# Altium project 100213563-EM411-202401.PrjPcb
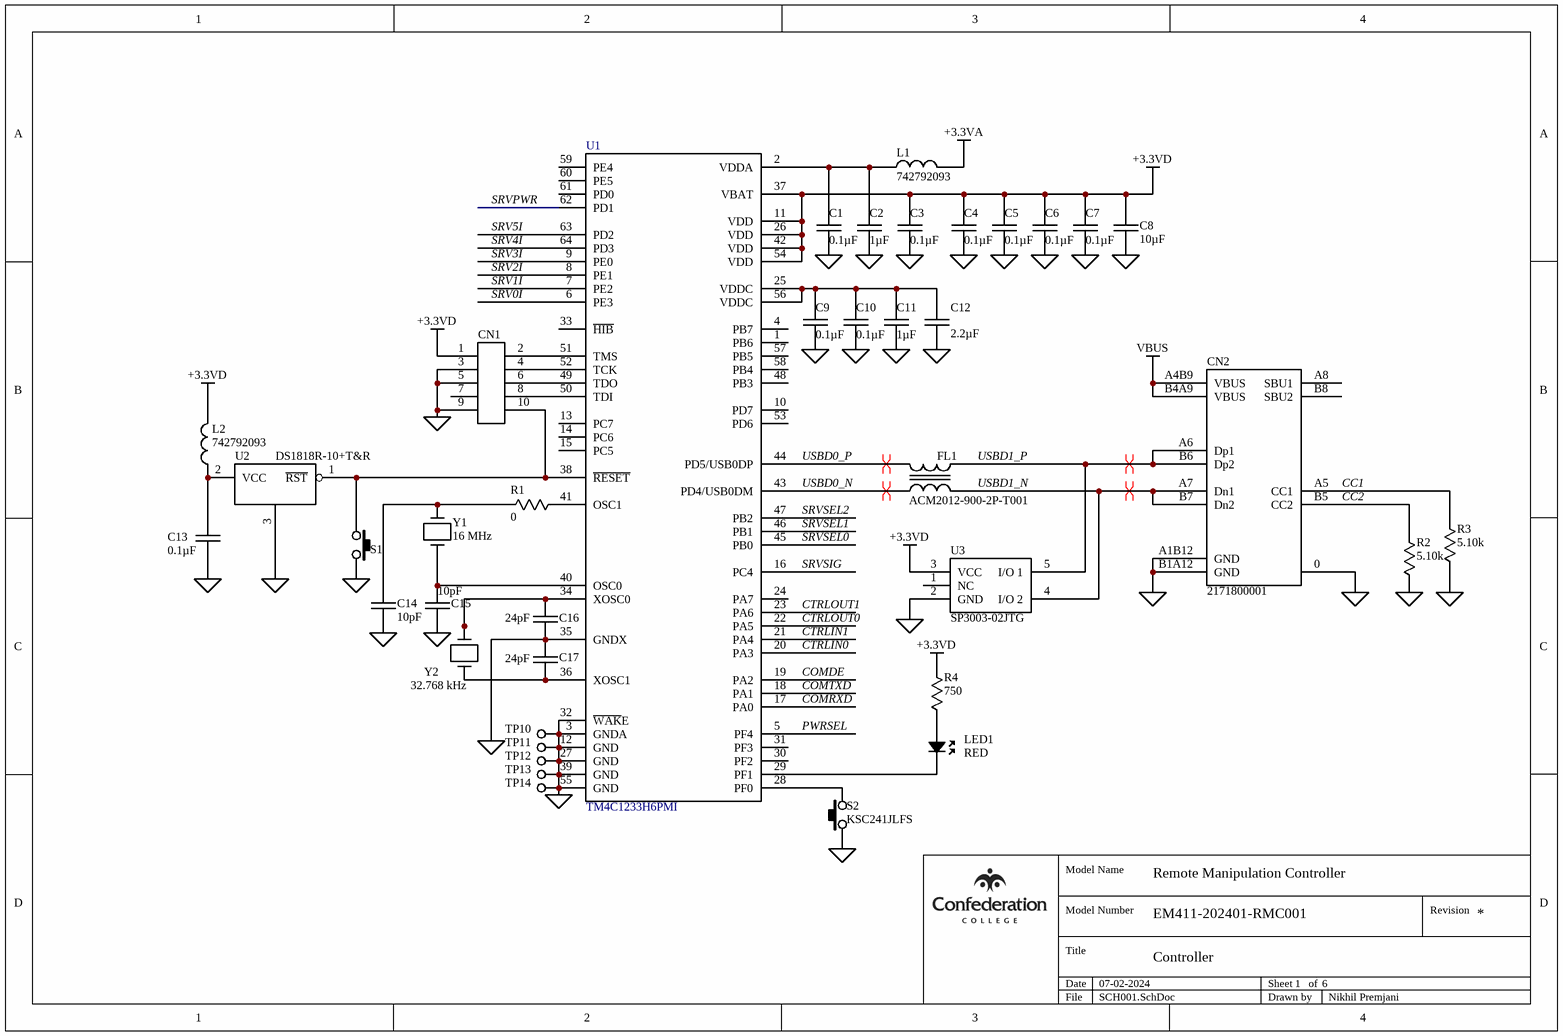
[diagram p0: SCH001.SchDoc]
6 sheets, 154 parts. Net scope: global (net labels, ports and power ports of the same name join across sheets).
Board file: PCB1.PcbDoc
Sheets:
  SCH001.SchDoc
  SCH002.SchDoc
  SCH003.SchDoc
  SCH004.SchDoc
  SCH005.SchDoc
  SCH006.SchDoc

## Sheet SCH001.SchDoc: Controller
size A4; Date: 07-02-2024; CompanyName: Confederation College; DrawnBy: Nikhil Premjani; SheetNumber: 1; SheetTotal: 6; Model: Remote Manipulation Controller; ModelNumber: EM411-202401-RMC001; ModelName: Remote Manipulation Controller

### Parts
C1  0.1µF  [CAPC2012X14N]
C2  1µF  [CAPC2012X14N]
C3  0.1µF  [CAPC2012X14N]
C4  0.1µF  [CAPC2012X14N]
C5  0.1µF  [CAPC2012X14N]
C6  0.1µF  [CAPC2012X14N]
C7  0.1µF  [CAPC2012X14N]
C8  10µF  [CAPC2012X14N]
C9  0.1µF  [CAPC2012X14N]
C10  0.1µF  [CAPC2012X14N]
C11  1µF  [CAPC2012X14N]
C12  2.2µF  [CAPC2012X14N]
C13  0.1µF  [CAPC2012X14N]
C14  10pF  [CAPC2012X09N]
C15  10pF  [CAPC2012X09N]
C16  24pF  [CAPC2012X09N]
C17  24pF  [CAPC2012X09N]
CN1  GRPB052VWVN-RC  [SULLINS_GRPB052VWVN-RC]  (value not drawn)
CN2  2171800001  [MOLEX_2171800001]
FL1  ACM2012-900-2P-T001  [LITTELFUSE_ACM2012-900-2P-T001]
L1  742792093  [INDC2012X11N]
L2  742792093  [INDC2012X11N]
LED1  RED  [LEDM3228X19N]
R1  0  [VISHAY_RESC2012X06N]
R2  5.10k  [RESC2012X06N]
R3  5.10k  [RESC2012X06N]
R4  750  [RESC2012X06N]
S1  KSC241JLFS  [CK_KSC241JLFS]  (value not drawn)
S2  KSC241JLFS  [CK_KSC241JLFS]
TP10  Test Point  [TP100]  (value not drawn)  (no BOM)
TP11  Test Point  [TP100]  (value not drawn)  (no BOM)
TP12  Test Point  [TP100]  (value not drawn)  (no BOM)
TP13  Test Point  [TP100]  (value not drawn)  (no BOM)
TP14  Test Point  [TP100]  (value not drawn)  (no BOM)
U1  TM4C1233H6PMI  [TSQFP50P1200X1200X145-64N]
U2  DS1818R-10+T&R  [SOT95P237X112-3N]
U3  SP3003-02JTG  [SOT65P220X110-5N]
Y1  16 MHz  [ABRACON_ABM3]
Y2  32.768 kHz  [ABRACON_AB26TRB]

### Nets
+3.3VA: L1.2
+3.3VD: C3.1 C4.1 C5.1 C6.1 C7.1 C8.1 CN1.1 L2.2 R4.2 U1.11(VDD) U1.26(VDD) U1.37(VBAT) U1.42(VDD) U1.54(VDD) U3.3(VCC)
GND: C1.2 C2.2 C3.2 C4.2 C5.2 C6.2 C7.2 C8.2 C9.2 C10.2 C11.2 C12.2 C13.2 C14.2 C15.2 C16.2 C17.1 CN1.3 CN1.5 CN1.9 CN2.0 CN2.A1B12(GND) CN2.B1A12(GND) R2.1 R3.1 S1.1 S2.2 TP10.1 TP11.1 TP12.1 TP13.1 TP14.1 U1.3(GNDA) U1.12(GND) U1.27(GND) U1.32(~{WAK}E) U1.35(GNDX) U1.39(GND) U1.55(GND) U2.3(GND) U3.2(GND)
VBUS: CN2.A4B9(VBUS) CN2.B4A9(VBUS)
CC1: CN2.A5(CC1) R3.2
CC2: CN2.B5(CC2) R2.2
COMDE: U1.19(PA2)
COMRXD: U1.17(PA0)
COMTXD: U1.18(PA1)
CTRLIN0: U1.20(PA3)
CTRLIN1: U1.21(PA4)
CTRLOUT0: U1.22(PA5)
CTRLOUT1: U1.23(PA6)
PWRSEL: U1.5(PF4)
SRV0I: U1.6(PE3)
SRV1I: U1.7(PE2)
SRV2I: U1.8(PE1)
SRV3I: U1.9(PE0)
SRV4I: U1.64(PD3)
SRV5I: U1.63(PD2)
SRVPWR: U1.62(PD1)
SRVSEL0: U1.45(PB0)
SRVSEL1: U1.46(PB1)
SRVSEL2: U1.47(PB2)
SRVSIG: U1.16(PC4)
USBD0_N: FL1.2 U1.43(PD4/USB0DM)
USBD0_P: FL1.1 U1.44(PD5/USB0DP)
USBD1_N: CN2.A7(Dn1) CN2.B7(Dn2) FL1.3 U3.4(I/O_2)
USBD1_P: CN2.A6(Dp1) CN2.B6(Dp2) FL1.4 U3.5(I/O_1)
NetC1_1: C1.1 C2.1 L1.1 U1.2(VDDA)
NetC9_1: C9.1 C10.1 C11.1 C12.1 U1.25(VDDC) U1.56(VDDC)
NetC13_1: C13.1 L2.1 U2.2(VCC)
NetC14_1: C14.1 R1.1 Y1.1
NetC15_1: C15.1 U1.40(OSC0) Y1.2
NetC16_1: C16.1 U1.34(XOSC0) Y2.2
NetC17_2: C17.2 U1.36(XOSC1) Y2.1
NetCN1_2: CN1.2 U1.51(TMS)
NetCN1_4: CN1.4 U1.52(TCK)
NetCN1_6: CN1.6 U1.49(TDO)
NetCN1_8: CN1.8 U1.50(TDI)
NetCN1_10: CN1.10 S1.2 U1.38(~{RESET}) U2.1(~{RST})
NetLED1_A: LED1.A R4.1
NetLED1_K: LED1.K U1.29(PF1)
NetR1_2: R1.2 U1.41(OSC1)
NetS2_1: S2.1 U1.28(PF0)

Not connected (* = marked no-connect by the designer): CN1 7; CN2 A8(SBU1) B8(SBU2); U1 1(PB6) 4(PB7) 10(PD7) 13(PC7) 14(PC6) 15(PC5) 24(PA7) 30(PF2) 31(PF3) 33(~{HIB}) 48(PB3) 53(PD6) 57(PB5) 58(PB4) 59(PE4) 60(PE5) 61(PD0); U3 1(NC)

### Layout directives
differential pair; differential pair class USB: USBD0_N, USBD0_P, USBD1_N, USBD1_P

### Notes on the sheet
- Model Number
- Model Name
- Revision
- Title
- Date
- Sheet
- of
- File
- Drawn by

### Library data of the parts
C1 C3-C7 C9 C10 C13 = UMK212B7104KGHT: 0.1µF/50V/±10% X7R Ceramic Chip Capacitor; Manufacturer: Taiyo Yuden; PartNumber: UMK212B7104KGHT
C2 C11 = CL21B105KBFNNNG: 1µF/50V/±10% X7R Ceramic Chip Capacitor; Manufacturer: Samsung Electro-Mechanics; PartNumber: CL21B105KBFNNNG
C8 = CL21A106KAFN3NE: 10µF/25V 10% X5R Multi-Layer Ceramic Capacitor; Manufacturer: Samsung Electro-Mechanics; PartNumber: CL21A106KAFN3NE
C12 = UMK212BB7225KG-T: 2.2µF/50V/10% Multilayer Ceramic Chip Capacitor; Manufacturer: Taiyo Yuden; PartNumber: UMK212BB7225KG-T
C14 C15 = 08051A100KAT: 10pF/100V/±10% C0G (NP0) Ceramic Chip Capacitor; Manufacturer: Kyocera/AVX; PartNumber: 08051A100KAT
C16 C17 = 08055A240JAT: 24pF/50V/±5% C0G (NP0) Ceramic Chip Capacitor; Manufacturer: Kyocera/AVX; PartNumber: 08055A240JAT
CN1 = GRPB052VWVN-RC: .050"[1.27mm] Contact Centers, Male Header; Manufacturer: Sullins Connector Solutions, Inc.; PartNumber: GRPB052VWVN-RC
CN2 = 2171800001: USB-C Receptacle, Right-Angle, Surface Mount, Top Mount, Center Height 5.9mm, Single Row, 16 Circuits; Manufacturer: Molex; PartNumber: 2171800001
FL1 = ACM2012-900-2P-T001: Common Mode Filter; Manufacturer: TDK; PartNumber: ACM2012-900-2P-T001
L1 L2 = 742792093: Multilayer SMD Ferrite; Manufacturer: Wurth Elektronik; PartNumber: 742792093
LED1 = 597-3008-207F: Micro LED, 597 Series, Red, SMD LED; Manufacturer: Dialight Corporation; PartNumber: 597-3008-207F
R1 = CRCW08050000Z0EAHP: 0, Jumper, Pulse Proof, High Power Thick Film Chip Resistor; Manufacturer: Vishay Intertechnology; PartNumber: CRCW08050000Z0EAHP
R2 R3 = CR0805-FX-5101ELF: 5.10k, 1%, 0.125W Thick Film Chip Resistor; Manufacturer: Bourns; PartNumber: CR0805-FX-4421ELF
R4 = CR0805-FX-7500ELF: 750, 1%, 0.125W Thick Film Chip Resistor; Manufacturer: Bourns; PartNumber: CR0805-FX-7500ELF
S1 S2 = KSC241JLFS: KSC Series Sealed Tact Switch for SMT; Manufacturer: C&K Components; PartNumber: KSC241JLFS
TP10-TP14 = TP3: Test Point, Surface Mount, 3 mm; Manufacturer: Confederation College; PartNumber: N/A
U1 = TM4C1233H6PMI: Microcontroller; Manufacturer: Texas Instruments; PartNumber: TM4C1233H6PMI
U2 = DS1818R-10+T&R: 3.3 V EconoReset with Pushbutton; Manufacturer: Maxim Integrated; PartNumber: DS1818R-10+T&R
U3 = SP3003-02JTG: TVS Diode Array - Low Capacitance ESD Protection; Manufacturer: Littelfuse; PartNumber: SP3003-02JTG
Y1 = ABM3-16.000MHZ-B2-T: 16 MHz Miniature Ceramic SMD Crystal; Manufacturer: Abracon Corporation; PartNumber: ABM3-16.000MHZ-B2-T
Y2 = AB26TRB-32.768KHZ-T: 32.768 kHz Radial Can Crystal; Manufacturer: Abracon Corporation; PartNumber: AB26TRB-32.768KHZ-T

## Sheet SCH002.SchDoc: Servo Interface
size A4; Date: 07-02-2024; DrawnBy: Nikhil Premjani; SheetNumber: 2; SheetTotal: 6; ModelNumber: EM411-202401-RMC001; ModelName: Remote Manipulation Controller
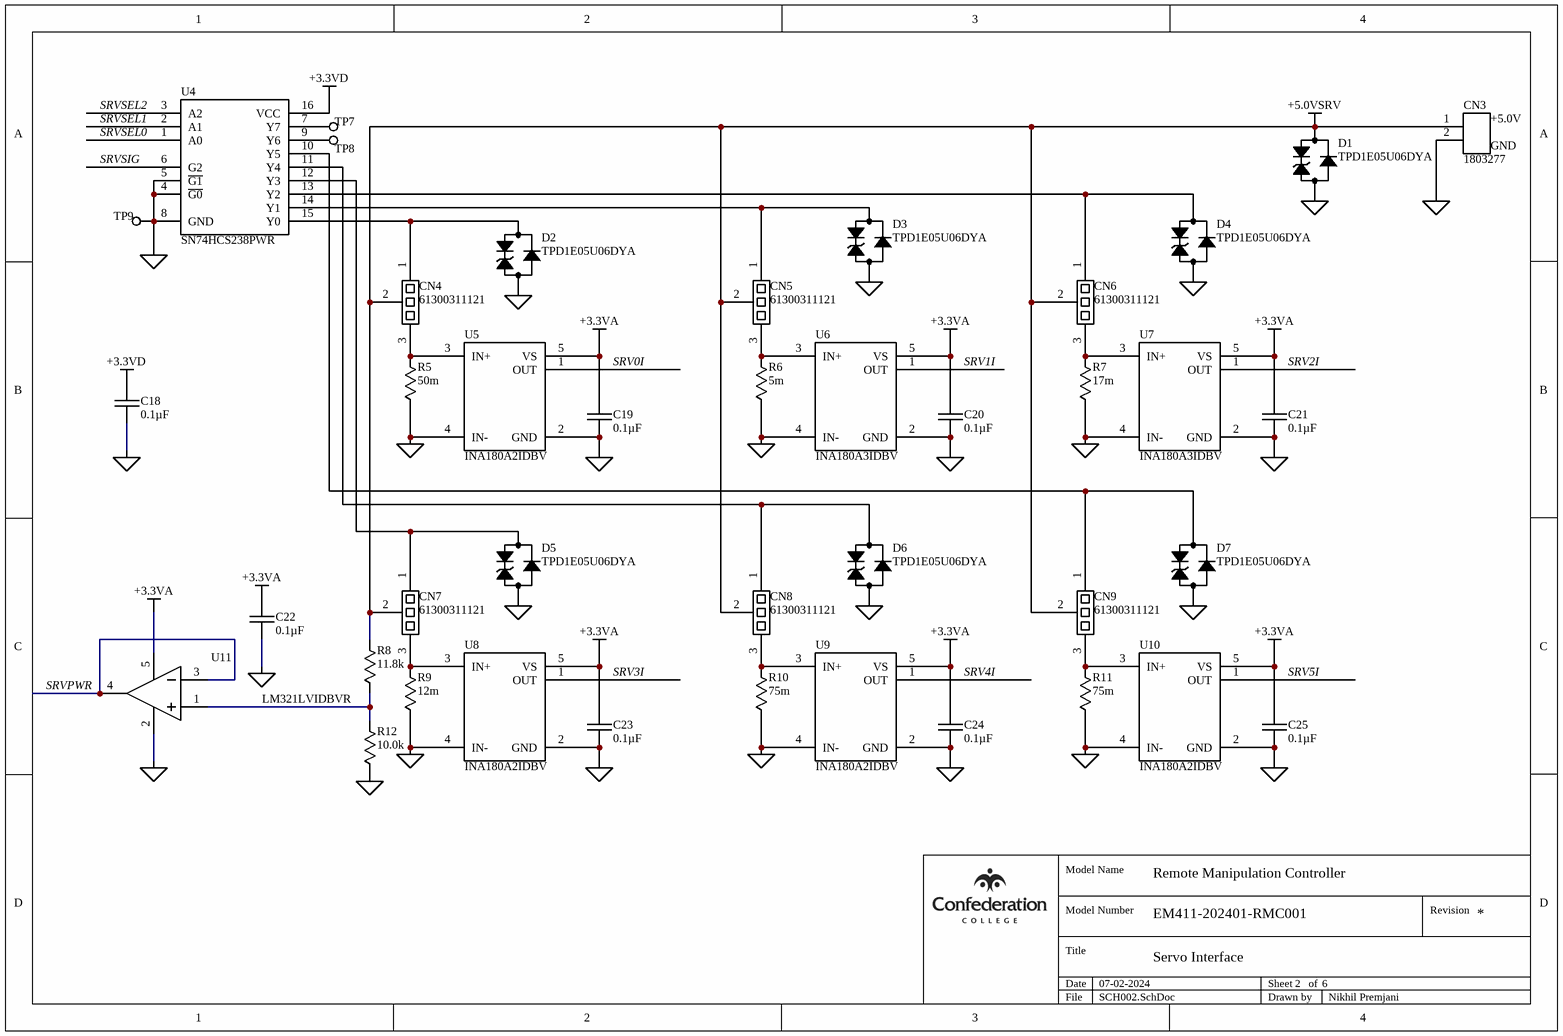
[diagram p1: SCH002.SchDoc]

### Parts
C18  0.1µF  [CAPC2012X14N]
C19  0.1µF  [CAPC2012X14N]
C20  0.1µF  [CAPC2012X14N]
C21  0.1µF  [CAPC2012X14N]
C22  0.1µF  [CAPC2012X14N]
C23  0.1µF  [CAPC2012X14N]
C24  0.1µF  [CAPC2012X14N]
C25  0.1µF  [CAPC2012X14N]
CN3  1803277  [PHOENIX_1803277]
CN4  61300311121  [WURTH_61300311121]
CN5  61300311121  [WURTH_61300311121]
CN6  61300311121  [WURTH_61300311121]
CN7  61300311121  [WURTH_61300311121]
CN8  61300311121  [WURTH_61300311121]
CN9  61300311121  [WURTH_61300311121]
D1  TPD1E05U06DYA  [SODFL160X77-2N]
D2  TPD1E05U06DYA  [SODFL160X77-2N]
D3  TPD1E05U06DYA  [SODFL160X77-2N]
D4  TPD1E05U06DYA  [SODFL160X77-2N]
D5  TPD1E05U06DYA  [SODFL160X77-2N]
D6  TPD1E05U06DYA  [SODFL160X77-2N]
D7  TPD1E05U06DYA  [SODFL160X77-2N]
R5  50m  [RESC2012X08N]
R6  5m  [RESC2012X08N]
R7  17m  [RESC2013X05N]
R8  11.8k  [RESC2012X06N]
R9  12m  [RESC2012X08N]
R10  75m  [RESC2012X08N]
R11  75m  [RESC2012X08N]
R12  10.0k  [RESC2012X06N]
TP7  Test Point  [TP100]  (value not drawn)  (no BOM)
TP8  Test Point  [TP100]  (value not drawn)  (no BOM)
TP9  Test Point  [TP100]  (value not drawn)  (no BOM)
U4  SN74HCS238PWR  [TSOP65P640X120-16N]
U5  INA180A2IDBV  [SOT95P280X145-5N]
U6  INA180A3IDBV  [SOT95P280X145-5N]
U7  INA180A3IDBV  [SOT95P280X145-5N]
U8  INA180A2IDBV  [SOT95P280X145-5N]
U9  INA180A2IDBV  [SOT95P280X145-5N]
U10  INA180A2IDBV  [SOT95P280X145-5N]
U11  LM321LVIDBVR  [SOT95P280X145-5N]

### Nets
+3.3VA: C19.1 C20.1 C21.1 C22.1 C23.1 C24.1 C25.1 U5.5(VS) U6.5(VS) U7.5(VS) U8.5(VS) U9.5(VS) U10.5(VS) U11.5(V+)
+3.3VD: C18.1 U4.16(VCC)
+5.0VSRV: CN3.1 CN4.2 CN5.2 CN6.2 CN7.2 CN8.2 CN9.2 D1.K R8.2
GND: C18.2 C19.2 C20.2 C21.2 C22.2 C23.2 C24.2 C25.2 CN3.2 D1.A D2.A D3.A D4.A D5.A D6.A D7.A R5.1 R6.1 R7.1 R9.1 R10.1 R11.1 R12.1 TP9.1 U4.4(~{G0}) U4.5(~{G1}) U4.8(GND) U5.2(GND) U5.4(IN-) U6.2(GND) U6.4(IN-) U7.2(GND) U7.4(IN-) U8.2(GND) U8.4(IN-) U9.2(GND) U9.4(IN-) U10.2(GND) U10.4(IN-) U11.2(V-)
SRV0I: U5.1(OUT)
SRV1I: U6.1(OUT)
SRV2I: U7.1(OUT)
SRV3I: U8.1(OUT)
SRV4I: U9.1(OUT)
SRV5I: U10.1(OUT)
SRVPWR: U11.3(IN-) U11.4(OUT)
SRVSEL0: U4.1(A0)
SRVSEL1: U4.2(A1)
SRVSEL2: U4.3(A2)
SRVSIG: U4.6(G2)
NetCN4_1: CN4.1 D2.K U4.15(Y0)
NetCN4_3: CN4.3 R5.2 U5.3(IN+)
NetCN5_1: CN5.1 D3.K U4.14(Y1)
NetCN5_3: CN5.3 R6.2 U6.3(IN+)
NetCN6_1: CN6.1 D4.K U4.13(Y2)
NetCN6_3: CN6.3 R7.2 U7.3(IN+)
NetCN7_1: CN7.1 D5.K U4.12(Y3)
NetCN7_3: CN7.3 R9.2 U8.3(IN+)
NetCN8_1: CN8.1 D6.K U4.11(Y4)
NetCN8_3: CN8.3 R10.2 U9.3(IN+)
NetCN9_1: CN9.1 D7.K U4.10(Y5)
NetCN9_3: CN9.3 R11.2 U10.3(IN+)
NetR8_1: R8.1 R12.2 U11.1(IN+)
NetTP7_1: TP7.1 U4.7(Y7)
NetTP8_1: TP8.1 U4.9(Y6)

### Notes on the sheet
- (near CN3) +5.0V
- (near CN3) GND
- Model Number
- Model Name
- Revision
- Title
- Date
- Sheet
- of
- File
- Drawn by

### Library data of the parts
C18-C25 = UMK212B7104KGHT: as C1 on sheet SCH001; PartNumber: UMK212B7104KGHT
CN3 = 1803277: MC 1,5/2G-3,81 Pluggable Terminal Block 2 Pos 3.81mm pitch Through Hole Header; Manufacturer: Phoenix Contact; PartNumber: 1803277
CN4-CN9 = 61300311121: Connector Header Through Hole 3 position 0.100" (2.54mm); Manufacturer: Wurth Elektronik; PartNumber: 61300311121
D1-D7 = TPD1E05U06DYA: Single-Channel ESD Protection Diode; Manufacturer: Texas Instruments; PartNumber: TPD1E05U06DYA
R5 = ERJ-6BWFR050V: 50m, 1%, 0.5W Thick Film Chip Resistor; Manufacturer: Panasonic; PartNumber: ERJ-6BWFR050V
R6 = CRF0805-FZ-R005ELF: 5m, 1%, 0.5W Thick Film Chip Resistor; Manufacturer: Bourns; PartNumber: CRF0805-FZ-R005ELF
R7 = WSLP0805R0170FEB: 17m, 1%, 0.5W Thick Film Chip Resistor; Manufacturer: Vishay Dale; PartNumber: WSLP0805R0170FEB
R8 = CR0805-FX-1182ELF: 11.8k, 1%, 0.125W Thick Film Chip Resistor; Manufacturer: Bourns; PartNumber: CR0805-FX-1182ELF
R9 = ERJ-6BWFR012V: 12m, 1%, 0.5W Thick Film Chip Resistor; Manufacturer: Panasonic; PartNumber: ERJ-6BWFR012V
R10 R11 = ERJ-6BWFR075V: 75m, 1%, 0.5W Thick Film Chip Resistor; Manufacturer: Panasonic; PartNumber: ERJ-6BWFR075V
R12 = CR0805-FX-1002ELF: 10.0k, 1%, 0.125W Thick Film Chip Resistor; Manufacturer: Bourns; PartNumber: CR0805-FX-1002ELF
TP7-TP9 = TP3: as TP10 on sheet SCH001; PartNumber: N/A
U4 = SN74HCS238PWR: 3-to 8-Line Decoder/Demultiplexer with Schmitt-Trigger Inputs; Manufacturer: Texas Instruments; PartNumber: SN74HCS238PWR
U5 U8-U10 = INA180A2IDBV: Voltage Output, Current-Sense Amplifiers, Gain 50; Manufacturer: Texas Instruments; PartNumber: INA180A2IDBV
U6 U7 = INA180A3IDBV: Voltage Output, Current-Sense Amplifiers, Gain 100; Manufacturer: Texas Instruments; PartNumber: INA180A3IDBV
U11 = LM321LVIDBVR: Industry Standard, Low Voltage Operational Amplifier; Manufacturer: Texas Instruments; PartNumber: LM321LVIDBVR

## Sheet SCH003.SchDoc: Power Supply
size A4; Date: 07-02-2024; DrawnBy: Nikhil Premjani; SheetNumber: 3; SheetTotal: 6; ModelNumber: EM411-202401-RMC001; ModelName: Remote Manipulation Controller
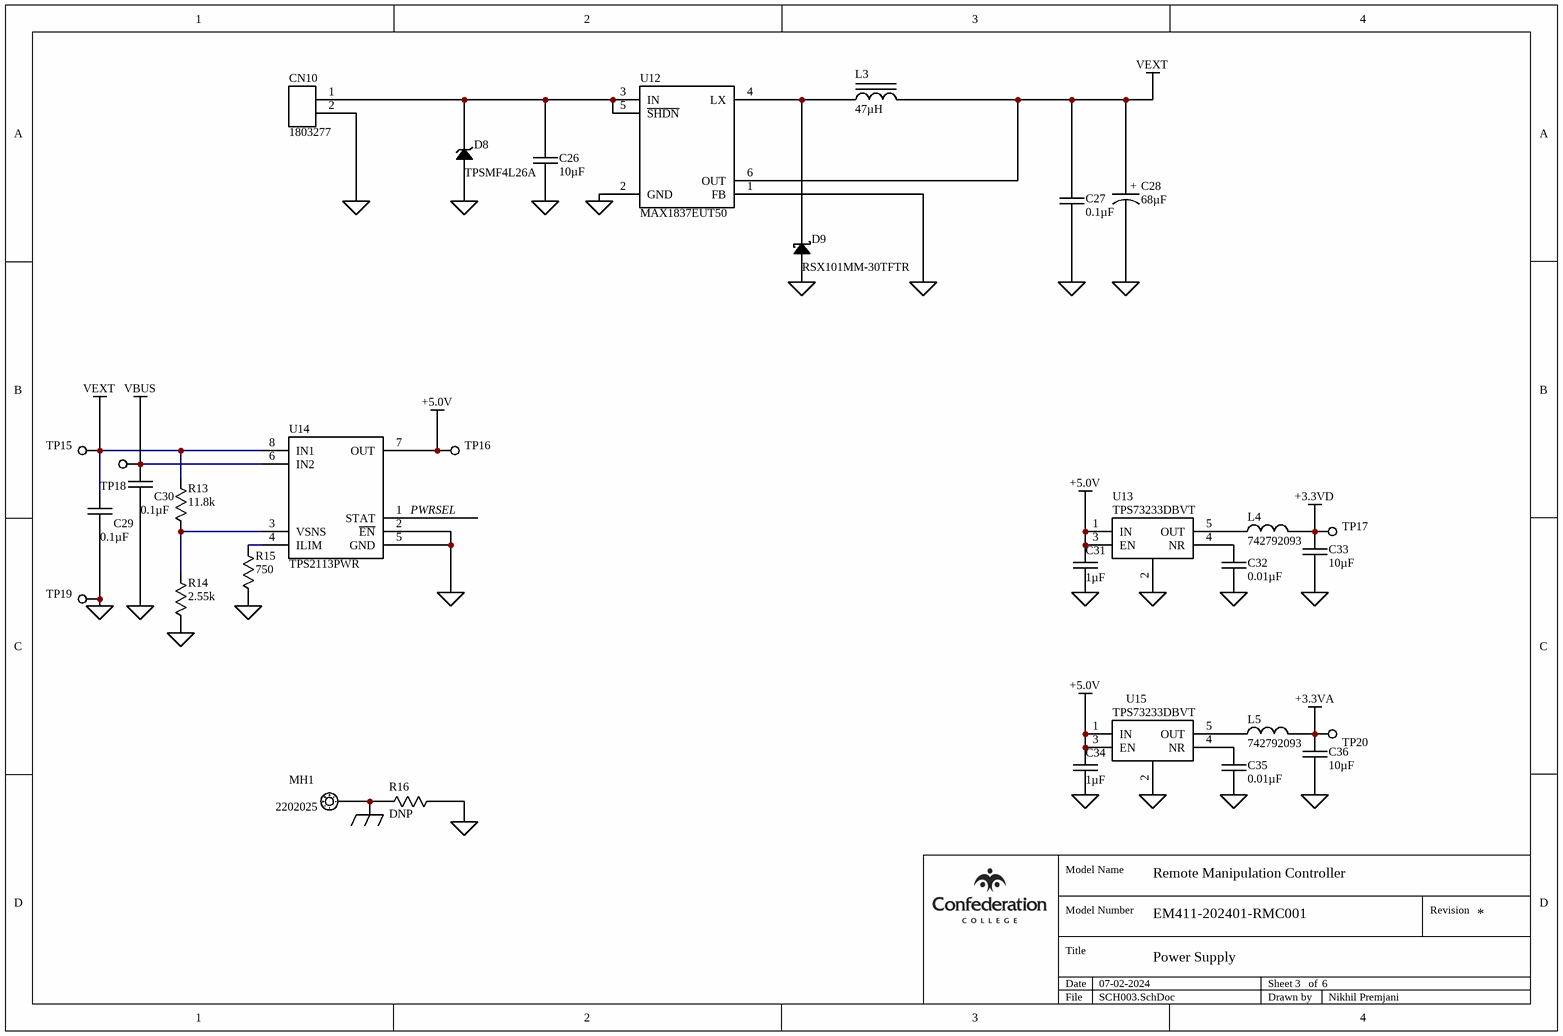
[diagram p2: SCH003.SchDoc]

### Parts
C26  10µF  [CAPC2012X14N]
C27  0.1µF  [CAPC2012X14N]
C28  68µF  [CAPAE7366X60M]
C29  0.1µF  [CAPC2012X14N]
C30  0.1µF  [CAPC2012X14N]
C31  1µF  [CAPC2012X14N]
C32  0.01µF  [CAPC2012X08N]
C33  10µF  [CAPC2012X14N]
C34  1µF  [CAPC2012X14N]
C35  0.01µF  [CAPC2012X08N]
C36  10µF  [CAPC2012X14N]
CN10  1803277  [PHOENIX_1803277]
D8  TPSMF4L26A  [SODFL370X108-2N]
D9  RSX101MM-30TFTR  [SODFL350X90-2N]
L3  47µH  [INDP102102X40N]
L4  742792093  [INDC2012X11N]
L5  742792093  [INDC2012X11N]
MH1  2202025  [PHOENIX_2202025]
R13  11.8k  [RESC2012X06N]
R14  2.55k  [RESC2012X06N]
R15  750  [RESC2012X06N]
R16  DNP  [RESC2012X06N]  (no BOM)
TP15  Test Point  [TP100]  (value not drawn)  (no BOM)
TP16  Test Point  [TP100]  (value not drawn)  (no BOM)
TP17  Test Point  [TP100]  (value not drawn)  (no BOM)
TP18  Test Point  [TP100]  (value not drawn)  (no BOM)
TP19  Test Point  [TP100]  (value not drawn)  (no BOM)
TP20  Test Point  [TP100]  (value not drawn)  (no BOM)
U12  MAX1837EUT50  [SOT95P280X145-6N]
U13  TPS73233DBVT  [SOT95P280X145-5N]
U14  TPS2113PWR  [TSOP65P640X120-8N]
U15  TPS73233DBVT  [SOT95P280X145-5N]

### Nets
+3.3VA: C36.1 L5.2 TP20.1
+3.3VD: C33.1 L4.2 TP17.1
+5.0V: C31.1 C34.1 TP16.1 U13.1(IN) U13.3(EN) U14.7(OUT) U15.1(IN) U15.3(EN)
CHGND: MH1.0 R16.1
GND: C26.2 C27.2 C28.2 C29.2 C30.2 C31.2 C32.2 C33.2 C34.2 C35.2 C36.2 CN10.2 D8.A D9.A R14.1 R15.1 R16.2 TP19.1 U12.1(FB) U12.2(GND) U13.2(GND) U14.2(~{EN}) U14.5(GND) U15.2(GND)
VBUS: C30.1 TP18.1 U14.6(IN2)
VEXT: C27.1 C28.1 C29.1 L3.1 R13.1 TP15.1 U12.6(OUT) U14.8(IN1)
PWRSEL: U14.1(STAT)
NetC26_1: C26.1 CN10.1 D8.K U12.3(IN) U12.5(~{SHDN})
NetC32_1: C32.1 U13.4(NR)
NetC35_1: C35.1 U15.4(NR)
NetD9_K: D9.K L3.2 U12.4(LX)
NetL4_1: L4.1 U13.5(OUT)
NetL5_1: L5.1 U15.5(OUT)
NetR13_2: R13.2 R14.2 U14.3(VSNS)
NetR15_2: R15.2 U14.4(ILIM)

### Notes on the sheet
- Model Number
- Model Name
- Revision
- Title
- Date
- Sheet
- of
- File
- Drawn by
- (in symbol APA0606680M010R) +

### Library data of the parts
C26 C33 C36 = CL21A106KAFN3NE: as C8 on sheet SCH001; PartNumber: CL21A106KAFN3NE
C27 C29 C30 = UMK212B7104KGHT: as C1 on sheet SCH001; PartNumber: UMK212B7104KGHT
C28 = APA0606680M010R: 68µF/10V/20% SMD Aluminum Conductive Polymer Electrolytic Capacitor; Manufacturer: AVX; PartNumber: APA0606680M010R
C31 C34 = CL21B105KBFNNNG: as C2 on sheet SCH001; PartNumber: CL21B105KBFNNNG
C32 C35 = CL21B103KBANNNC: 0.01µF/50V/±10% X7R Ceramic Chip Capacitor; Manufacturer: Samsung Electro-Mechanics; PartNumber: CL21B103KBANNNC
CN10 = 1803277: as CN3 on sheet SCH002; PartNumber: 1803277
D8 = TPSMF4L26A: TVS Diode; Manufacturer: Littelfuse; PartNumber: TPSMF4L26A
D9 = RSX101MM-30TFTR: Schottky Barrier Diode; Manufacturer: Rohm Semiconductor; PartNumber: RSX101MM-30TFTR
L3 = MSS1038-473MLC: 47µH Shielded Power Inductor; Manufacturer: Coilcraft; PartNumber: MSS1038-473MLC
L4 L5 = 742792093: as L1 on sheet SCH001; PartNumber: 742792093
MH1 = 2202025: UM-BASIC/PRO PE CONTACT L1; Manufacturer: Phoenix Contact; PartNumber: 2202025
R13 = CR0805-FX-1182ELF: as R8 on sheet SCH002; PartNumber: CR0805-FX-1182ELF
R14 = CR0805-FX-2551ELF: 2.55k, 1%, 0.125W Thick Film Chip Resistor; Manufacturer: Bourns; PartNumber: CR0805-FX-2551ELF
R15 = CR0805-FX-7500ELF: as R4 on sheet SCH001; PartNumber: CR0805-FX-7500ELF
R16 = DNP2012RES: Placeholder for 2012 Resistor; Manufacturer: Confederation College; PartNumber: DNP2012RES
TP15-TP20 = TP3: as TP10 on sheet SCH001; PartNumber: N/A
U12 = MAX1837EUT50: 24V Internal Switch, 100% Duty Cycle, Step-Down Converter; Manufacturer: Maxim Integrated; PartNumber: MAX1837EUT50
U13 U15 = TPS73233DBVT: 250 mA, 3.3V Low Dropout Voltage Regulator; Manufacturer: Texas Instruments; PartNumber: TPS73233DBVT
U14 = TPS2113PWR: Autoswitching Power Mux; Manufacturer: Texas Instruments; PartNumber: TPS2113PWR

## Sheet SCH004.SchDoc: Communication Interface
size A4; Date: 07-02-2024; DrawnBy: Nikhil Premjani; SheetNumber: 4; SheetTotal: 6; ModelNumber: EM411-202401-RMC001; ModelName: Remote Manipulation Controller
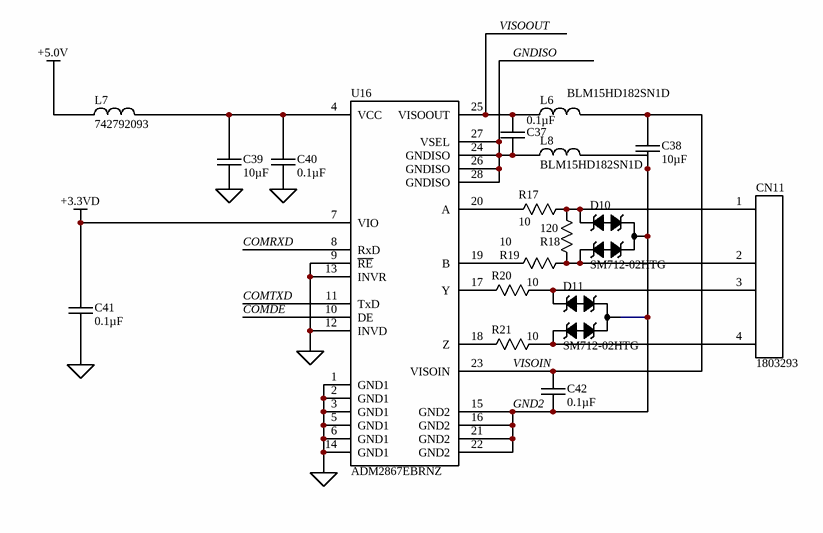
[diagram p3: SCH004.SchDoc]

### Parts
C37  0.1µF  [CAPC2012X14N]
C38  10µF  [CAPC2012X14N]
C39  10µF  [CAPC2012X14N]
C40  0.1µF  [CAPC2012X14N]
C41  0.1µF  [CAPC2012X14N]
C42  0.1µF  [CAPC2012X14N]
CN11  1803293  [PHOENIX_1803293]
D10  SM712-02HTG  [SOT95P237X112-3N]
D11  SM712-02HTG  [SOT95P237X112-3N]
L6  BLM15HD182SN1D  [INDC1005X06N]
L7  742792093  [INDC2012X11N]
L8  BLM15HD182SN1D  [INDC1005X06N]
R17  10  [RESC1608X06N]
R18  120  [RESC2012X06N]
R19  10  [RESC1608X06N]
R20  10  [RESC1608X06N]
R21  10  [RESC1608X06N]
U16  ADM2867EBRNZ  [SOP65P1030X265-28N]

### Nets
+3.3VD: C41.1 U16.7(VIO)
+5.0V: L7.1
GND: C39.2 C40.2 C41.2 U16.1(GND1) U16.2(GND1) U16.3(GND1) U16.5(GND1) U16.6(GND1) U16.9(~{RE}) U16.12(INVD) U16.13(INVR) U16.14(GND1)
COMDE: U16.10(DE)
COMRXD: U16.8(RxD)
COMTXD: U16.11(TxD)
GND2: C38.2 C42.2 D10.3 D11.3 L8.2 U16.15(GND2) U16.16(GND2) U16.21(GND2) U16.22(GND2)
GNDISO: C37.2 L8.1 U16.24(GNDISO) U16.26(GNDISO) U16.27(VSEL) U16.28(GNDISO)
VISOIN: C38.1 C42.1 L6.2 U16.23(VISOIN)
VISOOUT: C37.1 L6.1 U16.25(VISOOUT)
NetC39_1: C39.1 C40.1 L7.2 U16.4(VCC)
NetCN11_1: CN11.1 D10.1 R17.2 R18.2
NetCN11_2: CN11.2 D10.2 R18.1 R19.2
NetCN11_3: CN11.3 D11.1 R20.2
NetCN11_4: CN11.4 D11.2 R21.2
NetR17_1: R17.1 U16.20(A)
NetR19_1: R19.1 U16.19(B)
NetR20_1: R20.1 U16.17(Y)
NetR21_1: R21.1 U16.18(Z)

### Notes on the sheet
- Model Number
- Model Name
- Revision
- Title
- Date
- Sheet
- of
- File
- Drawn by

### Library data of the parts
C37 C40-C42 = UMK212B7104KGHT: as C1 on sheet SCH001; PartNumber: UMK212B7104KGHT
C38 C39 = CL21A106KAFN3NE: as C8 on sheet SCH001; PartNumber: CL21A106KAFN3NE
CN11 = 1803293: MC 1,5/4G-3,81 Pluggable Terminal Block 4 Pos 3.81mm pitch Through Hole Header; Manufacturer: Phoenix Contact; PartNumber: 1803293
D10 D11 = SM712-02HTG: SM712 Series 600W Asymmetrical TVS Diode Array; Manufacturer: Littelfuse; PartNumber: SM712-02HTG
L6 L8 = BLM15HD182SN1D: GHz Noise Suppression Chip Ferrite Bead; Manufacturer: Murata Electronics; PartNumber: BLM15HD182SN1D
L7 = 742792093: as L1 on sheet SCH001; PartNumber: 742792093
R17 R19-R21 = CRCW060310R0FKEAHP: 10, 1%, 0.33W Pulse Proof, High Power Thick Film Chip Resistor; Manufacturer: Vishay Intertechnology; PartNumber: CRCW060310R0FKEAHP
R18 = CR0805-FX-1200ELF: 120, 1%, 0.125W Thick Film Chip Resistor; Manufacturer: Bourns; PartNumber: CR0805-FX-1200ELF
U16 = ADM2867EBRNZ: 5.7 kV RMS Signal and Power Isolated RS-485 Transceiver with ±15 kV IEC ESD; Manufacturer: Analog Devices, Inc.; PartNumber: ADM2867EBRNZ

## Sheet SCH005.SchDoc: Digital Inputs
size A4; Date: 07-02-2024; DrawnBy: Nikhil Premjani; SheetNumber: 5; SheetTotal: 6; ModelNumber: EM411-202401-RMC001; ModelName: Remote Manipulation Controller
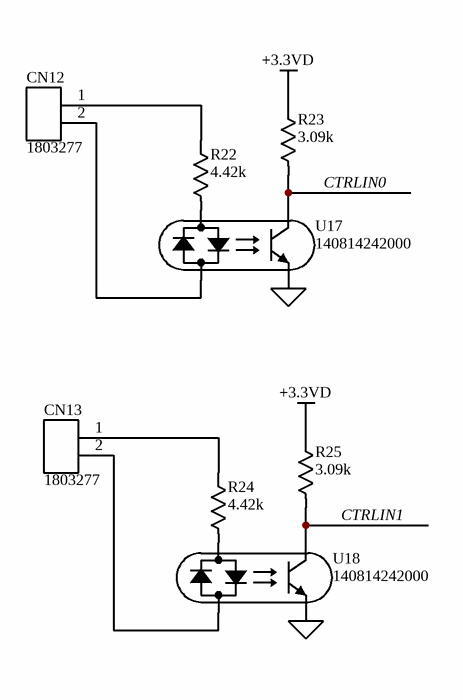
[diagram p4: SCH005.SchDoc]

### Parts
CN12  1803277  [PHOENIX_1803277]
CN13  1803277  [PHOENIX_1803277]
R22  4.42k  [RESC2012X06N]
R23  3.09k  [RESC2012X06N]
R24  4.42k  [RESC2012X06N]
R25  3.09k  [RESC2012X06N]
U17  140814242000  [WURTH_140814242000]
U18  140814242000  [WURTH_140814242000]

### Nets
+3.3VD: R23.2 R25.2
GND: U17.3(E) U18.3(E)
CTRLIN0: R23.1 U17.4(C)
CTRLIN1: R25.1 U18.4(C)
NetCN12_1: CN12.1 R22.2
NetCN12_2: CN12.2 U17.2(K)
NetCN13_1: CN13.1 R24.2
NetCN13_2: CN13.2 U18.2(K)
NetR22_1: R22.1 U17.1(A)
NetR24_1: R24.1 U18.1(A)

### Notes on the sheet
- Model Number
- Model Name
- Revision
- Title
- Date
- Sheet
- of
- File
- Drawn by

### Library data of the parts
CN12 CN13 = 1803277: as CN3 on sheet SCH002; PartNumber: 1803277
R22 R24 = CR0805-FX-4421ELF: 4.42k, 1%, 0.125W Thick Film Chip Resistor; Manufacturer: Bourns; PartNumber: CR0805-FX-4421ELF
R23 R25 = CR0805-FX-3091ELF: 3.09k, 1%, 0.125W Thick Film Chip Resistor; Manufacturer: Bourns; PartNumber: CR0805-FX-3091ELF
U17 U18 = 140814242000: WL-OCPT Optocoupler Phototransistor; Manufacturer: Wurth Elektronik; PartNumber: 140814242000

## Sheet SCH006.SchDoc: Digital Outputs
size A4; Date: 07-02-2024; DrawnBy: Nikhil Premjani; SheetNumber: 6; SheetTotal: 6; ModelNumber: Model Number; ModelName: Remote Manipulation Controller
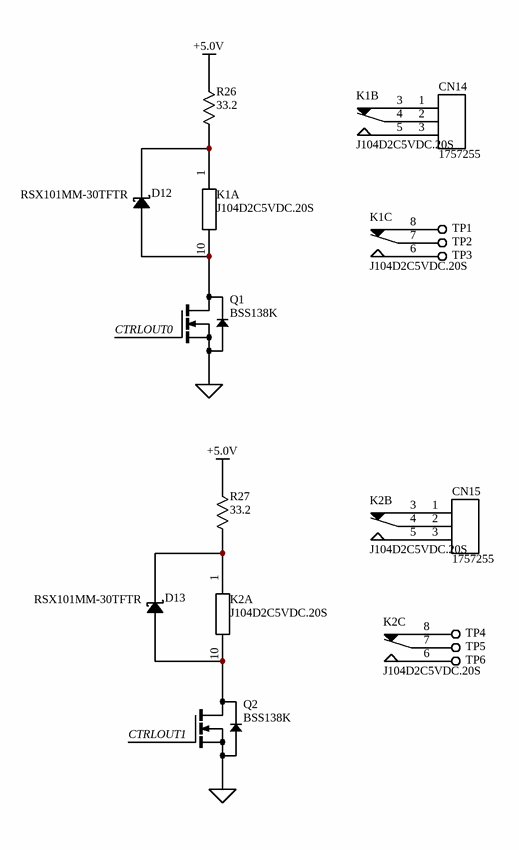
[diagram p5: SCH006.SchDoc]

### Parts
CN14  1757255  [PHOENIX_1757255]
CN15  1757255  [PHOENIX_1757255]
D12  RSX101MM-30TFTR  [SODFL350X90-2N]
D13  RSX101MM-30TFTR  [SODFL350X90-2N]
K1  J104D2C5VDC.20S  [CIT_J104D]  (parts A,B,C of 3)
K2  J104D2C5VDC.20S  [CIT_J104D]  (parts A,B,C of 3)
Q1  BSS138K  [SOT95P237X111-3N]
Q2  BSS138K  [SOT95P237X111-3N]
R26  33.2  [RESC2012X06N]
R27  33.2  [RESC2012X06N]
TP1  Test Point  [TP100]  (value not drawn)  (no BOM)
TP2  Test Point  [TP100]  (value not drawn)  (no BOM)
TP3  Test Point  [TP100]  (value not drawn)  (no BOM)
TP4  Test Point  [TP100]  (value not drawn)  (no BOM)
TP5  Test Point  [TP100]  (value not drawn)  (no BOM)
TP6  Test Point  [TP100]  (value not drawn)  (no BOM)

### Nets
+5.0V: R26.2 R27.2
GND: Q1.2(S) Q2.2(S)
CTRLOUT0: Q1.1(G)
CTRLOUT1: Q2.1(G)
NetCN14_1: CN14.1 K1.3
NetCN14_2: CN14.2 K1.4
NetCN14_3: CN14.3 K1.5
NetCN15_1: CN15.1 K2.3
NetCN15_2: CN15.2 K2.4
NetCN15_3: CN15.3 K2.5
NetD12_A: D12.A K1.10 Q1.3(D)
NetD12_K: D12.K K1.1 R26.1
NetD13_A: D13.A K2.10 Q2.3(D)
NetD13_K: D13.K K2.1 R27.1
NetK1_6: K1.6 TP3.1
NetK1_7: K1.7 TP2.1
NetK1_8: K1.8 TP1.1
NetK2_6: K2.6 TP6.1
NetK2_7: K2.7 TP5.1
NetK2_8: K2.8 TP4.1

### Notes on the sheet
- Model Number
- Model Name
- Revision
- Title
- Date
- Sheet
- of
- File
- Drawn by

### Library data of the parts
CN14 CN15 = 1757255: MSTBA 2,5/3-G-5,08 Pluggable Terminal Block 3 Pos 5.08mm pitch Through Hole Header; Manufacturer: Phoenix Contact; PartNumber: 1757255
D12 D13 = RSX101MM-30TFTR: as D9 on sheet SCH003; PartNumber: RSX101MM-30TFTR
K1 K2 = J104D2C5VDC.20S: J104D Series Dual Form C 5V, 2A PCB Relay; Manufacturer: Circuit Interrupter Technology; PartNumber: J104D2C5VDC.20S
Q1 Q2 = BSS138K: N-Channel Logic Level Enhancement Mode Field Effect Transistor; Manufacturer: Onsemi; PartNumber: BSS138K
R26 R27 = CR0805-FX-33R2ELF: 33.2, 1%, 0.125W Thick Film Chip Resistor; Manufacturer: Bourns; PartNumber: CR0805-FX-33R2ELF
TP1-TP6 = TP3: as TP10 on sheet SCH001; PartNumber: N/A

## Nets that join several sheets
+3.3VA: SCH001 (L1.2), SCH002 (14 pins), SCH003 (C36.1 L5.2 TP20.1)
+3.3VD: SCH001 (15 pins), SCH002 (C18.1 U4.16), SCH003 (C33.1 L4.2 TP17.1), SCH004 (C41.1 U16.7), SCH005 (R23.2 R25.2)
+5.0V: SCH003 (8 pins), SCH004 (L7.1), SCH006 (R26.2 R27.2)
GND: SCH001 (41 pins), SCH002 (40 pins), SCH003 (24 pins), SCH004 (12 pins), SCH005 (U17.3 U18.3), SCH006 (Q1.2 Q2.2)
VBUS: SCH001 (CN2.A4B9 CN2.B4A9), SCH003 (C30.1 TP18.1 U14.6)
COMDE: SCH001 (U1.19), SCH004 (U16.10)
COMRXD: SCH001 (U1.17), SCH004 (U16.8)
COMTXD: SCH001 (U1.18), SCH004 (U16.11)
CTRLIN0: SCH001 (U1.20), SCH005 (R23.1 U17.4)
CTRLIN1: SCH001 (U1.21), SCH005 (R25.1 U18.4)
CTRLOUT0: SCH001 (U1.22), SCH006 (Q1.1)
CTRLOUT1: SCH001 (U1.23), SCH006 (Q2.1)
PWRSEL: SCH001 (U1.5), SCH003 (U14.1)
SRV0I: SCH001 (U1.6), SCH002 (U5.1)
SRV1I: SCH001 (U1.7), SCH002 (U6.1)
SRV2I: SCH001 (U1.8), SCH002 (U7.1)
SRV3I: SCH001 (U1.9), SCH002 (U8.1)
SRV4I: SCH001 (U1.64), SCH002 (U9.1)
SRV5I: SCH001 (U1.63), SCH002 (U10.1)
SRVPWR: SCH001 (U1.62), SCH002 (U11.3 U11.4)
SRVSEL0: SCH001 (U1.45), SCH002 (U4.1)
SRVSEL1: SCH001 (U1.46), SCH002 (U4.2)
SRVSEL2: SCH001 (U1.47), SCH002 (U4.3)
SRVSIG: SCH001 (U1.16), SCH002 (U4.6)